# Altium project PCB_Project.PrjPcb
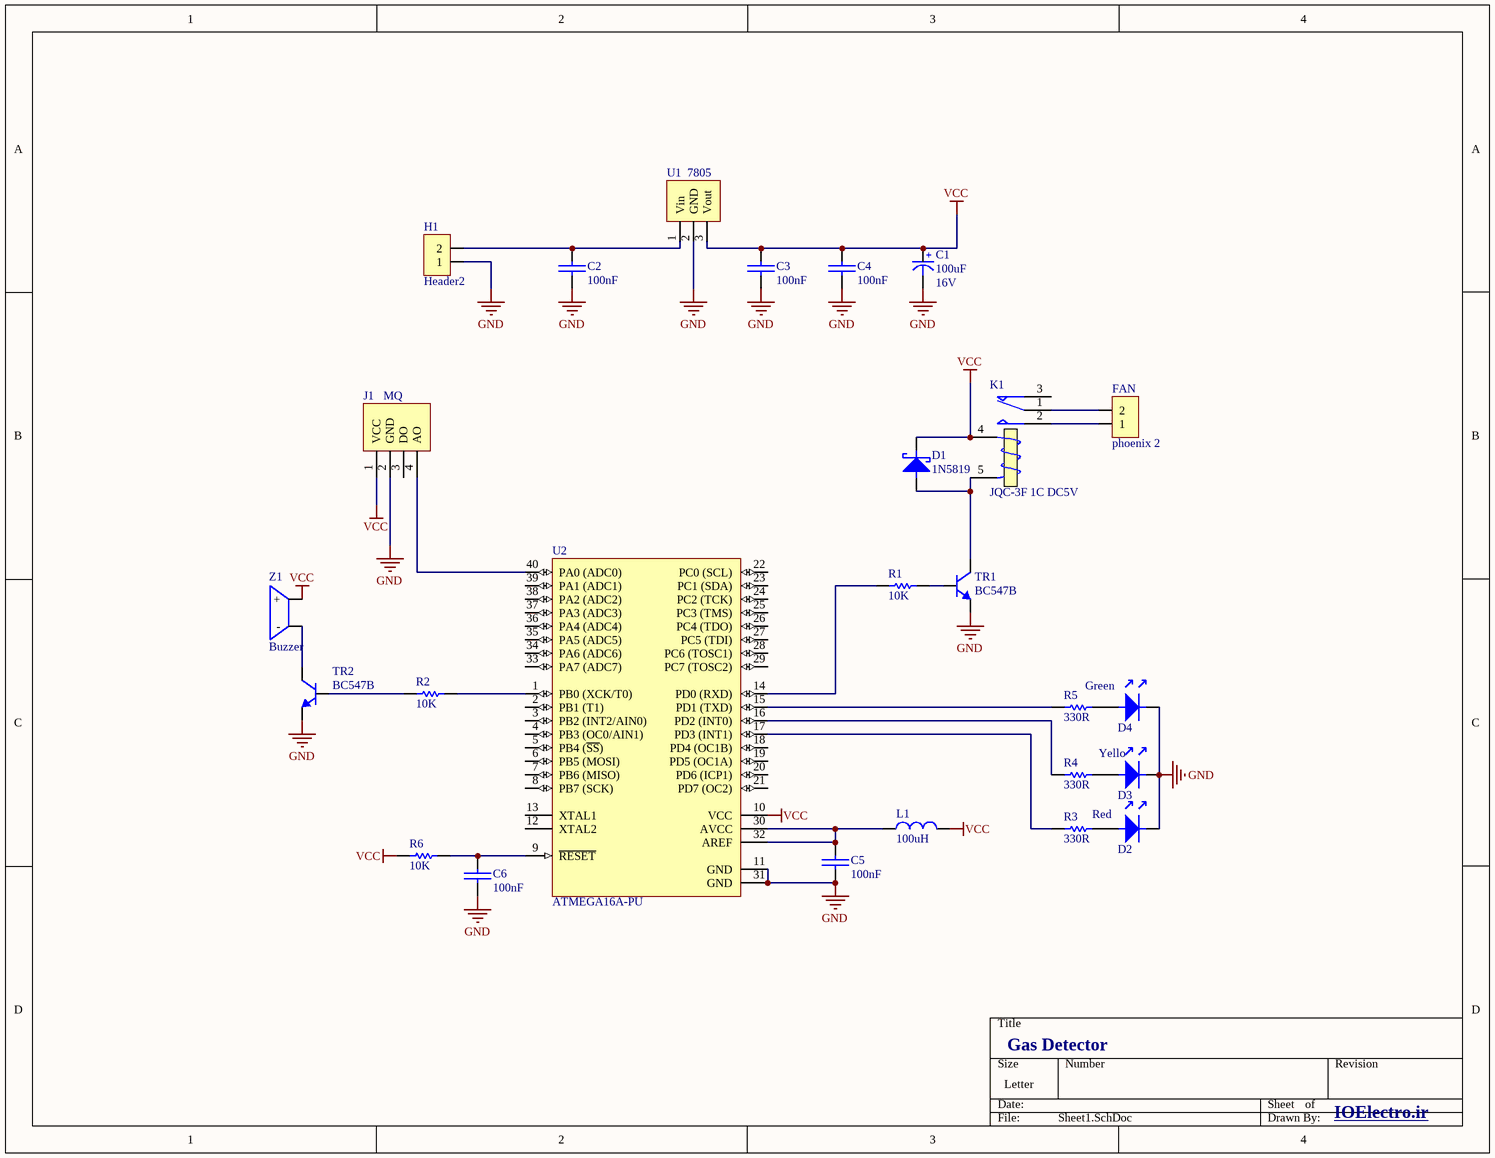
[diagram p0: Sheet1.SchDoc]
1 sheet, 26 parts. Net scope: global (net labels, ports and power ports of the same name join across sheets).
Board file: PCB1.PcbDoc

## Sheet Sheet1.SchDoc
size Letter

### Parts
C1  Voltage: 16V  [cap 03]  (hidden comment: 100uF)
C2  100nF  [Cap - 100nF]
C3  100nF  [Cap - 100nF]
C4  100nF  [Cap - 100nF]
C5  100nF  [Cap - 100nF]
C6  100nF  [Cap - 100nF]
D1  1N5819  [Diode_Axial_Lead]
D2  Red  [LED5MM]
D3  Yello  [LED5MM]
D4  Green  [LED5MM]
FAN  phoenix 2  [phonix-2]
H1  Header2  [HEADER-2]
J1  MQ  [MQ]
K1  JQC-3F 1C DC5V  [JQC-3F(T73)]
L1  100uH  [IND-DIP]
R1  10K  [RES-DIP]
R2  10K  [RES-DIP]
R3  330R  [RES-DIP]
R4  330R  [RES-DIP]
R5  330R  [RES-DIP]
R6  10K  [RES-DIP]
TR1  BC547B  [TO-92]
TR2  BC547B  [TO-92]
U1  7805  [TO-220]
U2  ATMEGA16A-PU  [DIP-40]
Z1  Buzzer  [BUZZER-TMB12A05]

### Nets
GND: C1.2(-) C2.2(-) C3.2(-) C4.2(-) C5.2(-) C6.2(-) D2.K D3.K D4.K H1.1 J1.2(GND) TR1.3(E) TR2.3(E) U1.2(GND) U2.11(GND) U2.31(GND)
VCC: C1.1(+) C3.1(+) C4.1(+) D1.K J1.1(VCC) K1.4(T1) L1.1 R6.1 U1.3(Vout) U2.10(VCC) Z1.2(+)
NetC2_1: C2.1(+) H1.2 U1.1(Vin)
NetC5_1: C5.1(+) L1.2 U2.30(AVCC) U2.32(AREF)
NetC6_1: C6.1(+) R6.2 U2.9(~{RESET})
NetD1_A: D1.A K1.5(T2) TR1.1(C)
NetD2_A: D2.A R3.2
NetD3_A: D3.A R4.2
NetD4_A: D4.A R5.2
NetFAN_1: FAN.1 K1.2(NO)
NetFAN_2: FAN.2 K1.1(COM)
NetJ1_4: J1.4(AO) U2.40(PA0_(ADC0))
NetR1_1: R1.1 U2.14(PD0_(RXD))
NetR1_2: R1.2 TR1.2(B)
NetR2_1: R2.1 TR2.2(B)
NetR2_2: R2.2 U2.1(PB0_(XCK/T0))
NetR3_1: R3.1 U2.17(PD3_(INT1))
NetR4_1: R4.1 U2.16(PD2_(INT0))
NetR5_1: R5.1 U2.15(PD1_(TXD))
NetTR2_1: TR2.1(C) Z1.1(-)

Not connected (* = marked no-connect by the designer): J1 3(DO); K1 3(NC); U2 2(PB1_(T1)) 3(PB2_(INT2/AIN0)) 4(PB3_(OC0/AIN1)) 5(PB4_(~{SS})) 6(PB5_(MOSI)) 7(PB6_(MISO)) 8(PB7_(SCK)) 12(XTAL2) 13(XTAL1) 18(PD4_(OC1B)) 19(PD5_(OC1A)) 20(PD6_(ICP1)) 21(PD7_(OC2)) 22(PC0_(SCL)) 23(PC1_(SDA)) 24(PC2_(TCK)) 25(PC3_(TMS)) 26(PC4_(TDO)) 27(PC5_(TDI)) 28(PC6_(TOSC1)) 29(PC7_(TOSC2)) 33(PA7_(ADC7)) 34(PA6_(ADC6)) 35(PA5_(ADC5)) 36(PA4_(ADC4)) 37(PA3_(ADC3)) 38(PA2_(ADC2)) 39(PA1_(ADC1))

### Notes on the sheet
- Gas Detector
- IOElectro.ir <http://ioelectro.ir>

### Library data of the parts
C1 = Cap-Polar: Polar Capacitor; Designer: Saeid Jorablo; Organazation: ControTec; Adding Date: 1387/12/20; Value: 100uF
C2-C6 = Cap-Bipolar: Bipolar Capacitor; Voltage: 100V; Designer: Saeid Jorablo; Organazation: ControTec; Adding Date: 1387/12/20; Value: 100nF
D1 = 1N5819: 1N58 Series 600 mV 1 A 40 V Max Reverse Voltage Schottky Barrier Rectifier-DO-41; Manufacturer: ON Semiconductor / Fairchild; Max Reverse Current: 500uA; Forward Voltage: 900mV; Forward Current: 1A; Max Repetitive Reverse Voltage (Vrrm): 40V; Peak Non-Repetitive Surge Current: 25A; Element Configuration: Single; Polarity: Standard; Capacitance: 110pF; Max Reverse Leakage Current: 1mA; Supplier 1: Digi-Key; Manufacturer Part Number: 1N5819; RoHS: Yes; Category: Schottky Diodes; Mount: Through Hole; Case/Package: DO-41; Number of Pins: 2; Weight: 0.245g; Contact Plating: Tin,Matte; Min Operating Temperature: -65°C; Max Operating Temperature: 125°C; Packaging: Tape and Reel; Package Quantity: 5000; Average Rectified Current: 1A; Voltage Rating (DC): 40V; Current Rating: 1A; Output Current: 1A; Max Reverse Voltage (DC): 40V; Max Surge Current: 25A; Max Forward Surge Current (Ifsm): 25A; Series: -; Diameter: 2.72mm; Length: 5.2mm; Width: 2.72mm; Height: 2.72mm; Radiation Hardening: No; RoHS Compliant: Yes; REACH SVHC: No SVHC; Lead Free: Lead Free; ComponentLink1URL: https://datasheet.ciiva.com/34302/1200637-34302074.pdf?src-supplier=Jameco; ComponentLink1Description: https://datasheet.ciiva.com/34302/1200637-34302074.pdf?src-supplier=Jameco; ComponentLink2URL: https://datasheet.ciiva.com/4719/1n5817-d-103200-4719059.pdf?src-supplier=Mouser; ComponentLink2Description: https://datasheet.ciiva.com/4719/1n5817-d-103200-4719059.pdf?src-supplier=Mouser; ComponentLink3URL: https://datasheet.ciiva.com/25951/1n5819-25951350.pdf?src-supplier=Avnet+Europe; ComponentLink3Description: https://datasheet.ciiva.com/25951/1n5819-25951350.pdf?src-supplier=Avnet+Europe; ComponentLink4URL: https://datasheet.ciiva.com/1177/1671052-1177084.pdf?src-supplier=Element14; ComponentLink4Description: https://datasheet.ciiva.com/1177/1671052-1177084.pdf?src-supplier=Element14; ComponentLink5URL: https://datasheet.ciiva.com/8300/1n5819-8300426.pdf?src-supplier=Avnet; ComponentLink5Description: https://datasheet.ciiva.com/8300/1n5819-8300426.pdf?src-supplier=Avnet; ComponentLink6URL: https://datasheet.ciiva.com/22651/1671052-22651942.pdf?src-supplier=Element14; ComponentLink6Description: https://datasheet.ciiva.com/22651/1671052-22651942.pdf?src-supplier=Element14; Supplier Part Number 1: 1N5819FSCT-ND
D2-D4 = LED
FAN = CONN-PH-2
H1 = HEADER-2
K1 = JQC-3F 1C DC5V: Relay Milon 5V 1Contact T73
L1 = Inductor
R1-R6 = RES-Dip: 1/4 W DIP
TR1 TR2 = BC547B: ON SEMICONDUCTOR - BC547B - Bipolar (BJT) Single Transistor, General Purpose, NPN, 45 V, 300 MHz, 500 mW, 100 mA, 110 hFE; Manufacturer: ON Semiconductor / Fairchild; Collector Emitter Voltage (VCEO): 45V; Max Power Dissipation: 500mW; Max Collector Current: 100mA; Collector Base Voltage (VCBO): 50V; Emitter Base Voltage (VEBO): 6V; Number of Elements: 1; hFE Min: 200; Frequency: 300MHz; Gain Bandwidth Product: 100MHz; Collector Emitter Saturation Voltage: 300mV; Voltage: 40V; Supplier 1: Digi-Key; Manufacturer Part Number: BC547B; RoHS: Yes; Category: BJTs; Stock 1: 3549; Pricing 1: 1=0/50000, 10=0/36900, 25=0/32280, 100=0/20890, 500=0/13832, 1000=0/10605, 2500=0/09222, 5000=0/08300 (USD); Mount: Through Hole; Case/Package: TO-92; Number of Pins: 3; Weight: 0.007055oz; Contact Plating: Copper,Tin,Silver; Min Operating Temperature: -65°C; Max Operating Temperature: 150°C; Packaging: Bulk; Polarity: NPN; Power Dissipation: 500mW; Element Configuration: Single; Package Quantity: 2000; Voltage Rating (DC): 45V; Current Rating: 100mA; Collector Emitter Breakdown Voltage: 45V; Transition Frequency: 300MHz; Max Frequency: 300MHz; Max Breakdown Voltage: 45V; Length: 4.58mm; Width: 3.86mm; Height: 4.58mm; Radiation Hardening: No; Lead Free: Lead Free; REACH SVHC: No SVHC; ComponentLink1URL: https://datasheet.ciiva.com/17011/bc547-17011404.pdf?src-supplier=Future+Electronics; ComponentLink1Description: https://datasheet.ciiva.com/17011/bc547-17011404.pdf?src-supplier=Future+Electronics; ComponentLink2URL: https://datasheet.ciiva.com/985/bc546-547-548rev5-985523.pdf?src-supplier=Digi-Key; ComponentLink2Description: https://datasheet.ciiva.com/985/bc546-547-548rev5-985523.pdf?src-supplier=Digi-Key; ComponentLink3URL: https://datasheet.ciiva.com/972/bc546-972262.pdf?src-supplier=Digi-Key; ComponentLink3Description: https://datasheet.ciiva.com/972/bc546-972262.pdf?src-supplier=Digi-Key; ComponentLink4URL: https://datasheet.ciiva.com/1195/1868820-1195464.pdf?src-supplier=Element14; ComponentLink4Description: https://datasheet.ciiva.com/1195/1868820-1195464.pdf?src-supplier=Element14; ComponentLink5URL: https://datasheet.ciiva.com/25996/bc550-25996616.pdf?src-supplier=Avnet+Europe; ComponentLink5Description: https://datasheet.ciiva.com/25996/bc550-25996616.pdf?src-supplier=Avnet+Europe; ComponentLink6URL: https://datasheet.ciiva.com/11197/bc550-11197769.pdf?src-supplier=Avnet; ComponentLink6Description: https://datasheet.ciiva.com/11197/bc550-11197769.pdf?src-supplier=Avnet; ComponentLink7URL: https://datasheet.ciiva.com/16472/bc550-16472201.pdf?src-supplier=Avnet+Asia; ComponentLink7Description: https://datasheet.ciiva.com/16472/bc550-16472201.pdf?src-supplier=Avnet+Asia; Supplier Part Number 1: BC547BFS-ND
U2 = ATMEGA16A-PU: MCU 8-Bit ATmega AVR RISC 16KB Flash 3.3V/5V 40-Pin PDIP; Manufacturer: Microchip / Atmel; Frequency: 16MHz; Interface: I2C,SPI,UART,USART,2-Wire; Number of I/Os: 32; Oscillator Type: Internal; Peripherals: Brown-out Detect/Reset,POR,PWM,WDT; RAM Size: 1KB; Max Supply Voltage: 5.5V; Min Supply Voltage: 2.7V; Number of Timers/Counters: 3; Number of PWM Channels: 4; Number of ADC Channels: 8; Data Bus Width: 8b; Number of SPI Channels: 1; Watchdog Timer: Yes; Supplier 1: Digi-Key; Manufacturer Part Number: ATMEGA16A-PU; RoHS: Yes; Category: Microcontrollers; Stock 1: 31; Pricing 1: 1=3/96000, 25=3/63400, 100=3/28900 (USD); Mount: Through Hole; Case/Package: PDIP; Number of Pins: 40; Contact Plating: Tin,Matte; Min Operating Temperature: -40°C; Max Operating Temperature: 85°C; Core Architecture: AVR; Package Quantity: 10; Packaging: Rail/Tube; Memory Type: FLASH; Memory Size: 16KB; Series: AVR® ATmega; Number of Programmable I/O: 32; Max Frequency: 16MHz; Number of I2C Channels: 1; Length: 52.58mm; Width: 13.97mm; Height: 4.445mm; Radiation Hardening: No; REACH SVHC: No SVHC; Lead Free: Lead Free; ComponentLink1URL: https://datasheet.ciiva.com/26860/getdatasheetpartid-464499-26860340.pdf?src-supplier=Verical; ComponentLink1Description: https://datasheet.ciiva.com/26860/getdatasheetpartid-464499-26860340.pdf?src-supplier=Verical; ComponentLink2URL: https://datasheet.ciiva.com/14633/0900766b80db4e44-14633395.pdf?src-supplier=Allied+Electronics; ComponentLink2Description: https://datasheet.ciiva.com/14633/0900766b80db4e44-14633395.pdf?src-supplier=Allied+Electronics; ComponentLink3URL: https://datasheet.ciiva.com/1157/466147-1157513.pdf?src-supplier=Element14; ComponentLink3Description: https://datasheet.ciiva.com/1157/466147-1157513.pdf?src-supplier=Element14; Supplier Part Number 1: ATMEGA16A-PU-ND